# Altium schematic sheet 04 GPIO ASSIGNMENT.SchDoc
size 420 x 297 mm
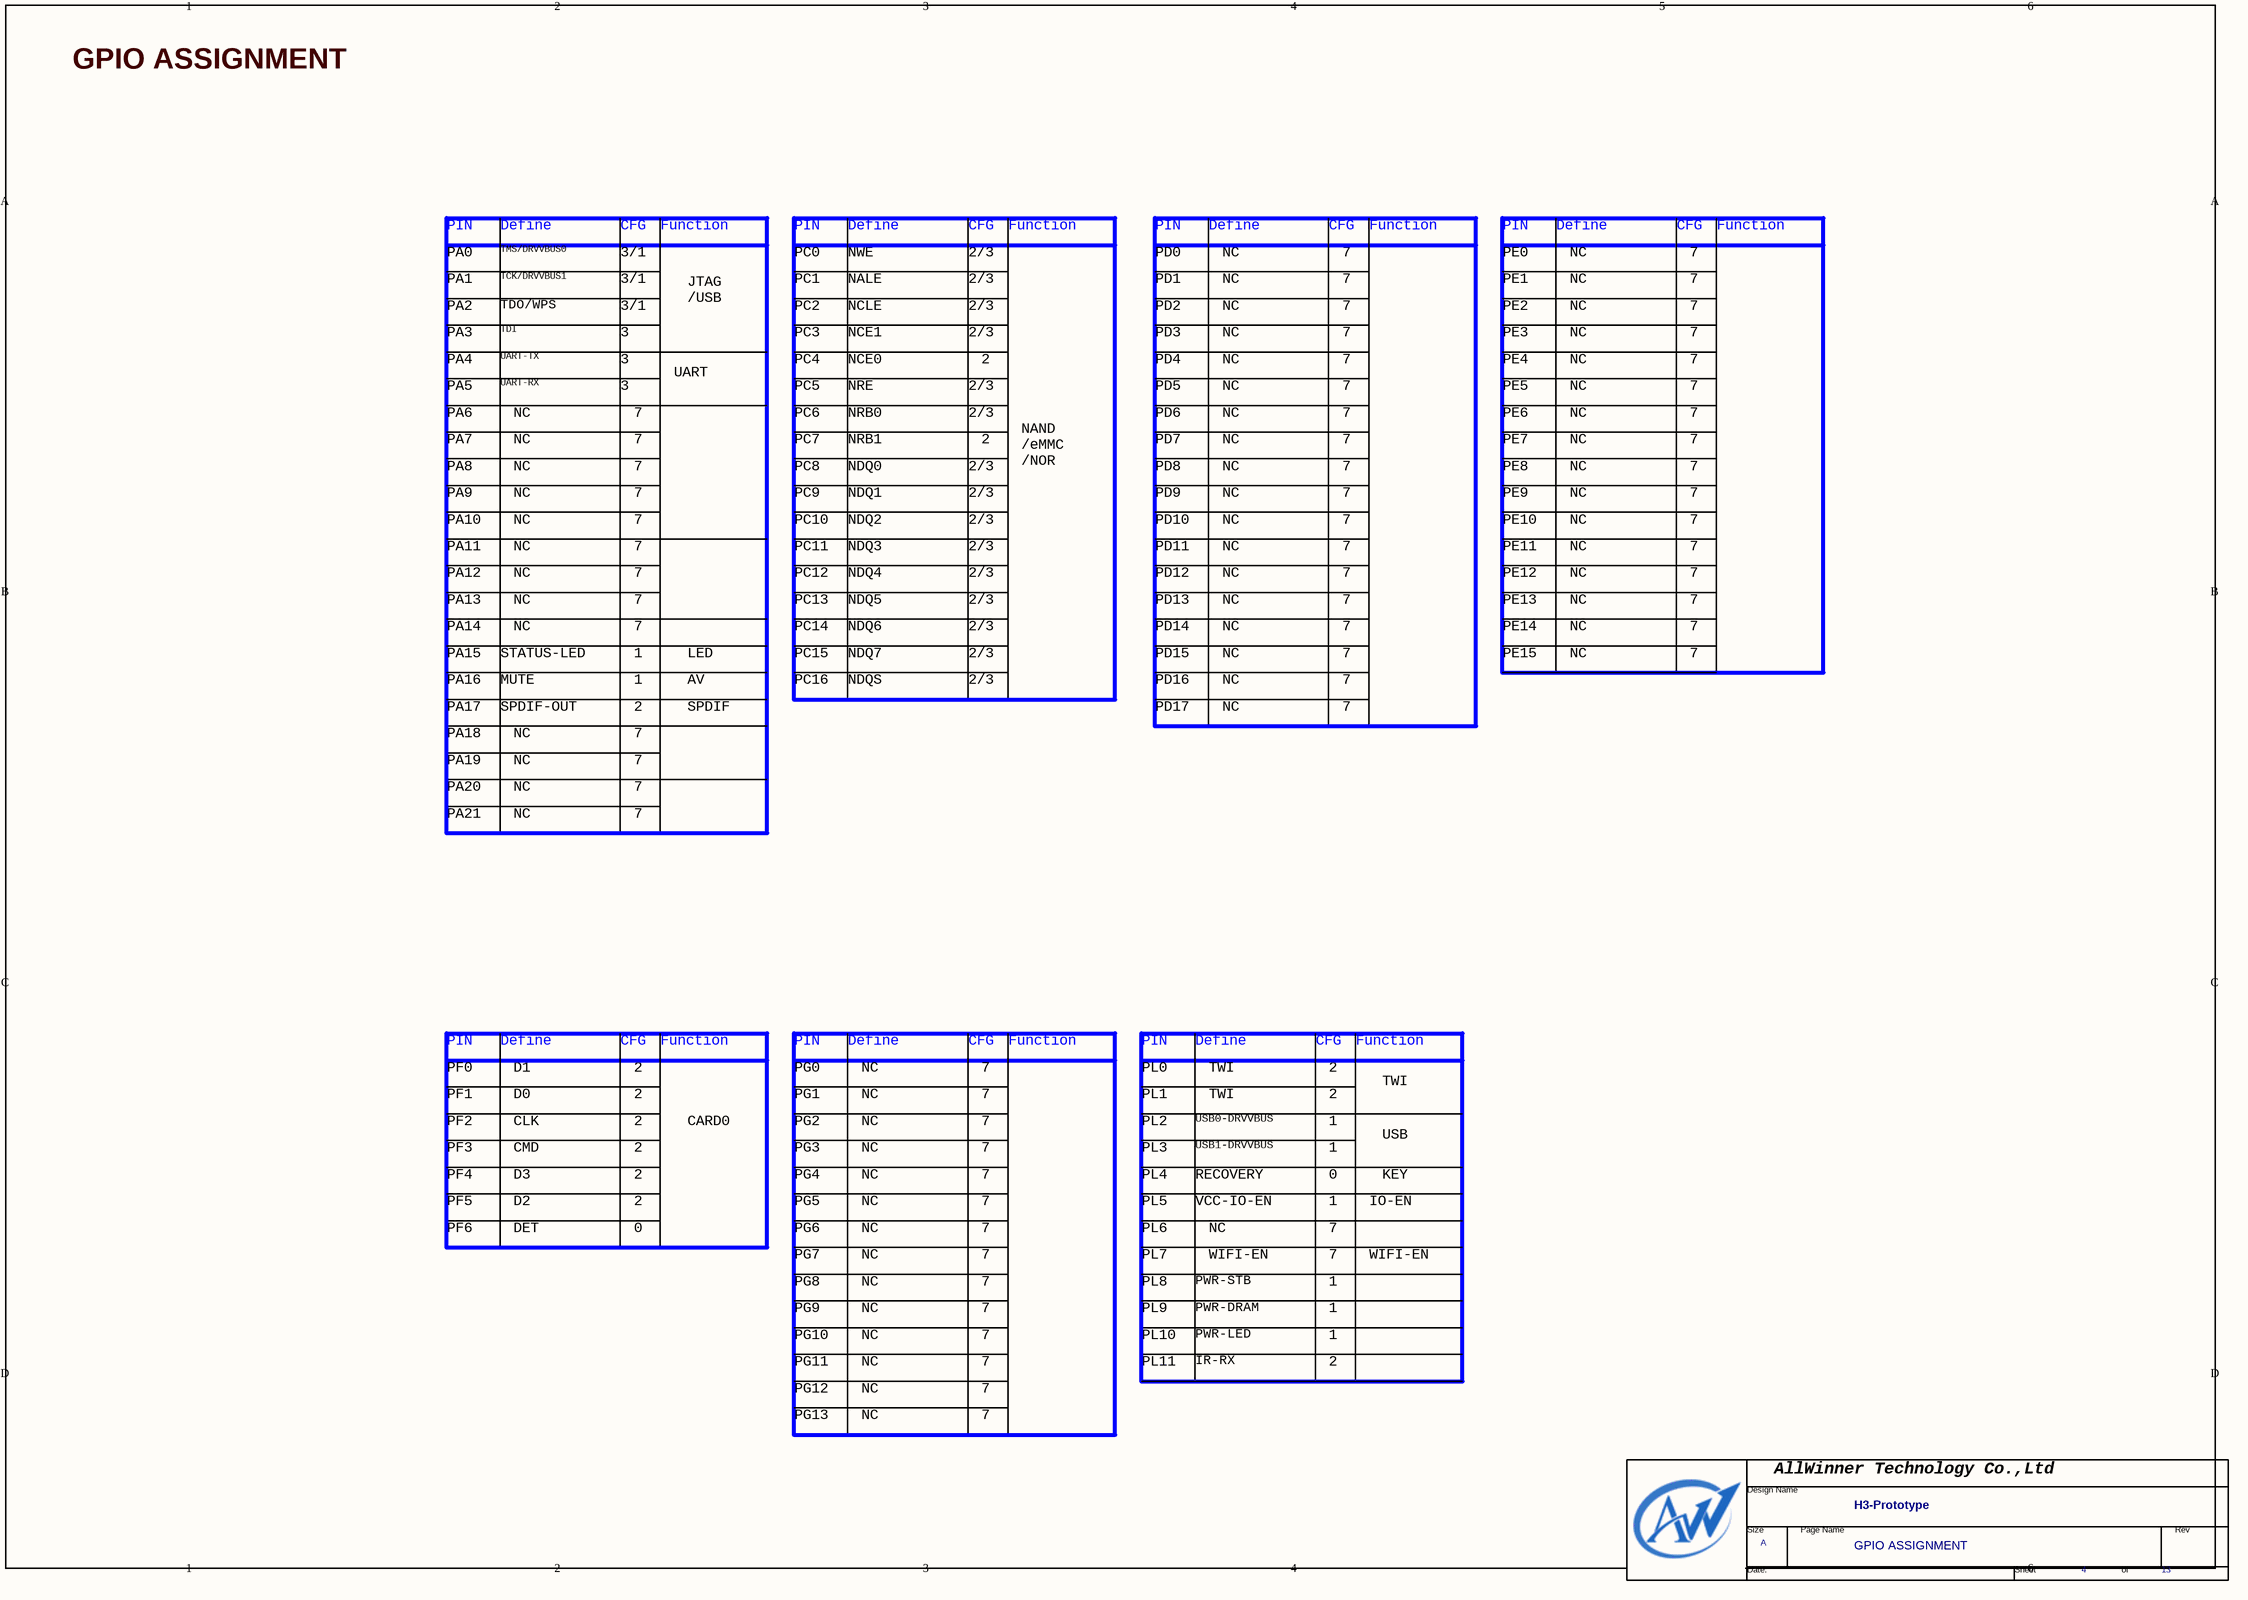
[diagram p0: 04 GPIO ASSIGNMENT.SchDoc]

## Parts
*  Page Count: 13  Page Number: 4  Page Size: A  Title: H3-Prototype  Doc: GPIO ASSIGNMENT  (hidden comment: TitleBlock0-AW)  (graphical)

## Notes on the sheet
- GPIO ASSIGNMENT
- PIN
- PA0
- Define
- TMS/DRVVBUS0
- CFG
- 3/1
- Function
- PC0
- NWE
- 2/3
- PD0
- NC
- 7
- PE0
- PA1
- PA2
- TCK/DRVVBUS1
- TDO/WPS
- JTAG
  /USB
- PC1
- PC2
- NALE
- NCLE
- PD1
- PD2
- PE1
- PE2
- PA3
- PA4
- PA5
- TDI
- UART-TX
- UART-RX
- 3
- UART
- PC3
- PC4
- PC5
- NCE1
- NCE0
- NRE
- 2
- PD3
- PD4
- PD5
- PE3
- PE4
- PE5
- PA6
- PA7
- PC6
- PC7
- NRB0
- NRB1
- NAND
  /eMMC
  /NOR
- PD6
- PD7
- PE6
- PE7
- PA8
- PA9
- PA10
- PC8
- PC9
- PC10
- NDQ1
- NDQ2
- NDQ0
- PD8
- PD9
- PD10
- PE8
- PE9
- PE10
- PA11
- PA12
- PC11
- PC12
- NDQ3
- NDQ4
- PD11
- PD12
- PE11
- PE12
- PA13
- PA14
- PA15
- STATUS-LED
- 1
- LED
- PC13
- PC14
- PC15
- NDQ5
- NDQ6
- NDQ7
- PD13
- PD14
- PD15
- PE13
- PE14
- PE15
- PA16
- PA17
- SPDIF-OUT
- MUTE
- SPDIF
- AV
- PC16
- NDQS
- PD16
- PD17
- PA18
- PA19
- PA20
- PA21
- PF0
- PF1
- PF2
- D0
- D1
- CLK
- CARD0
- PG0
- PG1
- PG2
- PL0
- PL1
- PL2
- USB0-DRVVBUS
- TWI
- PF3
- PF4
- D3
- CMD
- PG3
- PG4
- PL3
- PL4
- RECOVERY
- USB1-DRVVBUS
- 0
- KEY
- USB
- PF6
- PF5
- D2
- DET
- PG5
- PG6
- PG7
- PL5
- PL6
- PL7
- VCC-IO-EN
- WIFI-EN
- IO-EN
- PG8
- PG9
- PL8
- PL9
- PWR-DRAM
- PWR-STB
- PG10
- PG11
- PG12
- PL10
- PL11
- IR-RX
- PWR-LED
- PG13
- (in symbol TitleBlock0-AW) AllWinner Technology Co.,Ltd; Design Name; Size; Page Name; Rev; Date:; Sheet; of

## Library data of the parts
* = TitleBlock0-AW: Page Create Date: March  8, 1995